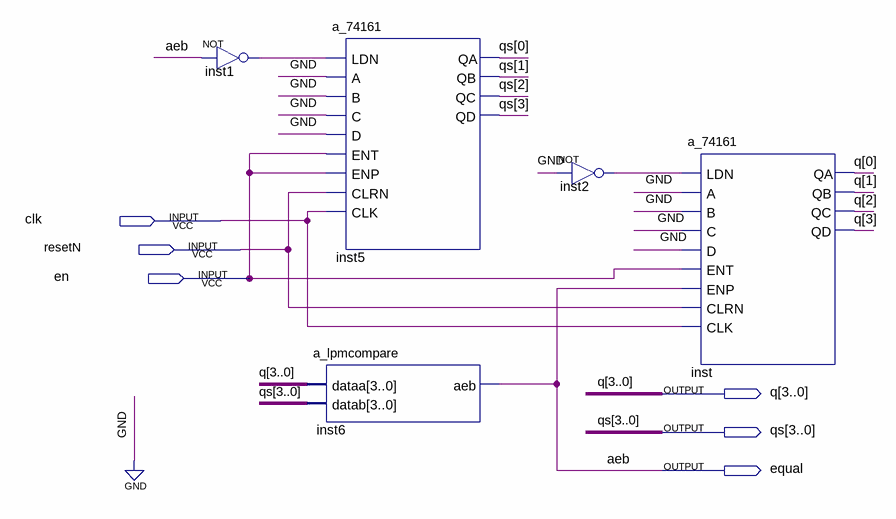
[diagram p0: schematic sheet]
// Quartus schematic mitnapeah.bdf as structural Verilog: 5 symbols, 6 pins
module mitnapeah (
  input  clk,
  input  resetN,
  input  en,
  output [3:0] q,
  output [3:0] qs,
  output equal
);

  wire inst1_out, inst2_out;

  not inst1 (inst1_out, equal);
  a_74161 inst5 (
    .LDN(inst1_out), .A(1'b0), .B(1'b0), .C(1'b0), .D(1'b0), .ENT(en), .ENP(en), .CLRN(resetN), .CLK(clk),
    .QA(qs[0]), .QB(qs[1]), .QC(qs[2]), .QD(qs[3]));
  a_lpmcompare inst6 (.dataa(q), .datab(qs), .aeb(equal));
  not inst2 (inst2_out, 1'b0);
  a_74161 inst (
    .LDN(inst2_out), .A(1'b0), .B(1'b0), .C(1'b0), .D(1'b0), .ENT(en), .ENP(equal), .CLRN(resetN), .CLK(clk),
    .QA(q[0]), .QB(q[1]), .QC(q[2]), .QD(q[3]));

  // Other names for the same wires on the sheet: aeb = equal
endmodule
